# EAGLE schematic testHeader (EAGLE 7.3.0)
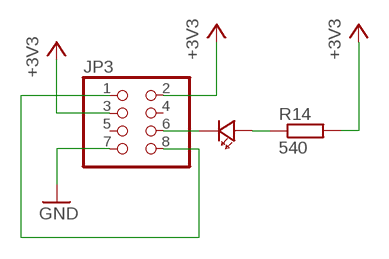
[diagram p0: schematic, sheet 1]

## Parts
JP3  PINHD-2X4  [2X04]
LED-TX2  LED0805  [CHIPLED_0805]
R14  540  R-EU_R0805  [R0805]

## Nets
+3V3: JP3.2 JP3.3 R14.2
GND: JP3.7
N$23: JP3.1 JP3.8
N$24: JP3.6 LED-TX2.C
N$25: LED-TX2.A R14.1
Unconnected: JP3.4 JP3.5

## Library data of the parts
JP3 = pinhead:PINHD-2X4: PIN HEADER
LED-TX2 = p.peter-leds:LED
R14 = p.peter-rcl:R-EU_: RESISTOR, European symbol